# Altium schematic sheet E-08 eMMC.SchDoc: FRDM-IMX93
size 513 x 386 mm; DrawnBy: FORLINX; Organization: ORGANIZATION; Address1: ADDRESS 1; Address2: ADDRESS 2; Address3: ADDRESS 3; Address4: ADDRESS 4; Revision: -; ENG_APP_DATE: --/--/--; DSN_APP_DATE: --/--/--; CHK_APP_DATE: --/--/--; Classification: Public, Company Internal/Proprietary, Company Confidential,  Company Secret; Page Create Date: March  8, 1995; OrgName: NXP Semiconductor; FIUO: A; OrgAddr1: NO. 192 Liangjing Rd. Pudong New Area, ShangHai; Page Number: 8; PageTitle: eMMC; Page Size: C; Comment: TitleBlock_MCPG; Page Count: 23; Designer: FORLINX; RevCode: B1; Approver: NXP SE; Doc: SCH-94611 PDF: SPF-94611; DsnPath: T:\FILES\Designs\Single Board Computers\i.MX93-FRDM\Design Files\SCH-94611_B1.DSN; SchematicName: FRDM-i.MX 93 Development Board; PageName: E-08 eMMC; PageSize: C; TopSchematic: True
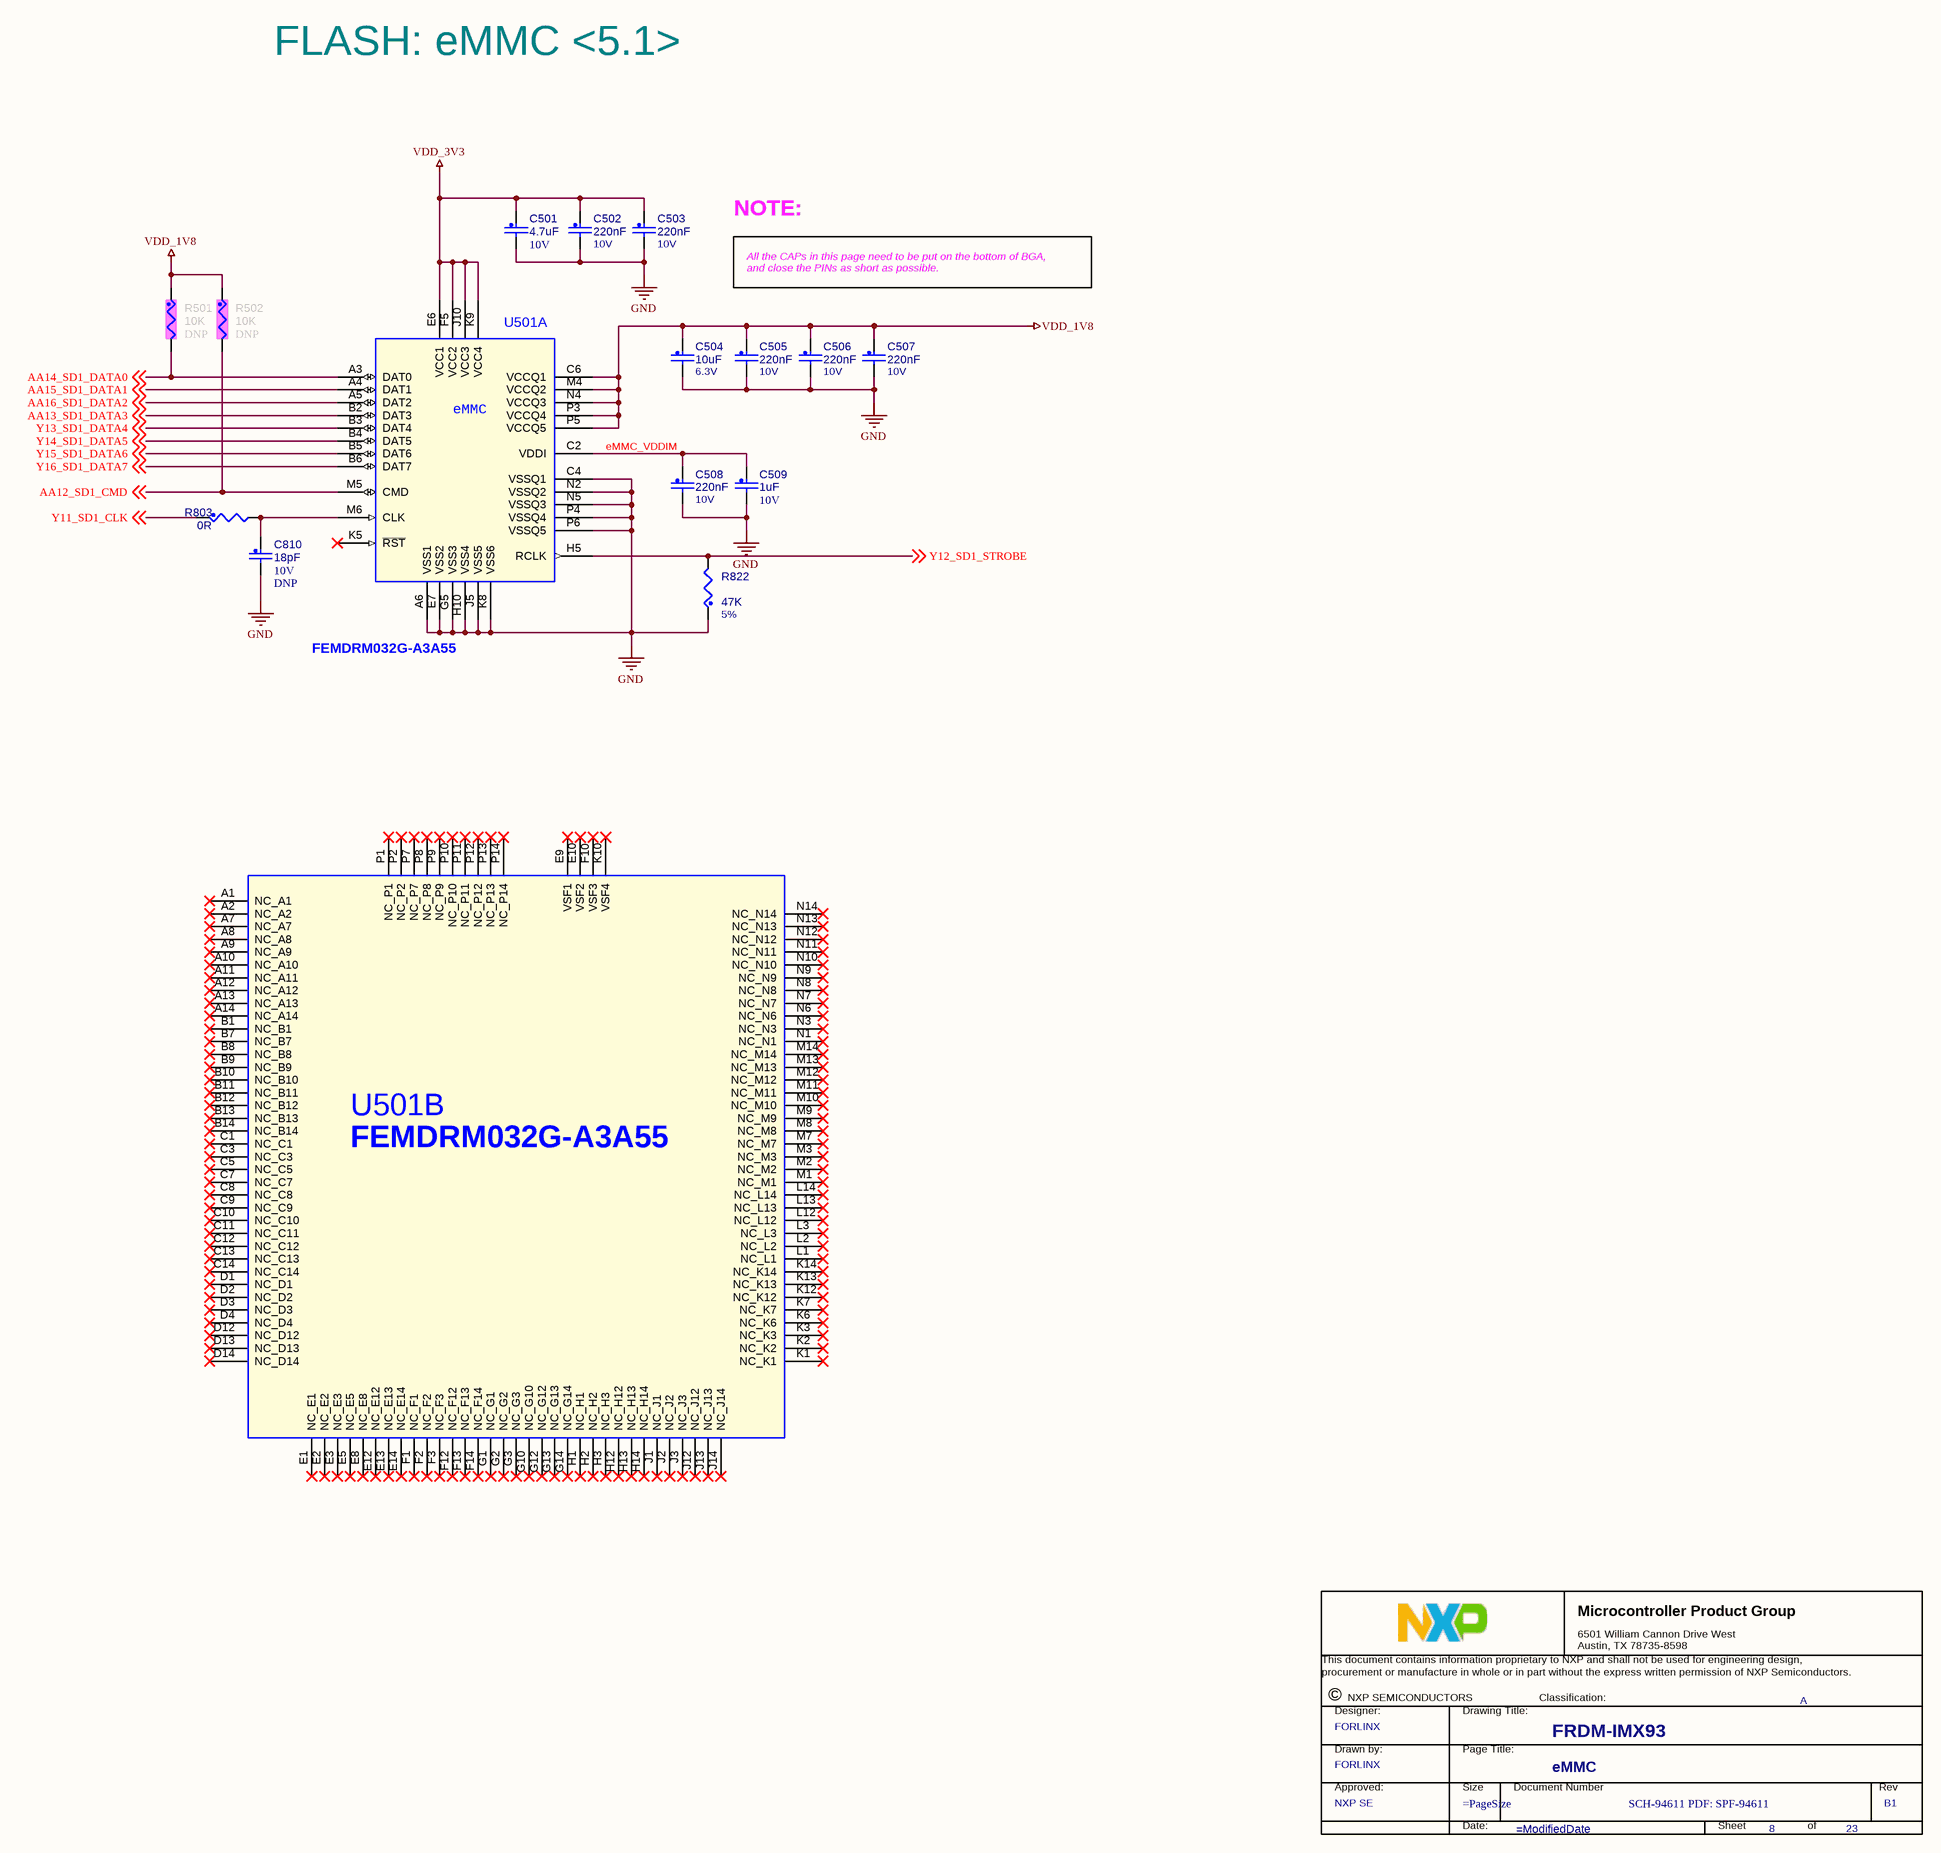
[diagram p0: E-08 eMMC.SchDoc]

## Parts
*  Title: FRDM-IMX93  RevCode: B1  PageTitle: eMMC  Page Number: 8  Page Count: 23  DrawnBy: FORLINX  Doc: SCH-94611 PDF: SPF-94611  Approver: NXP SE  FIUO: A  (hidden comment: TitleBlock_MCPG)  (graphical)
C501  4.7uF  VOLTAGE: 10V  [C0402]
C502  220nF  VOLTAGE: 10V  [C0201]
C503  220nF  VOLTAGE: 10V  [C0201]
C504  10uF  VOLTAGE: 6.3V  [C0402]
C505  220nF  VOLTAGE: 10V  [C0201]
C506  220nF  VOLTAGE: 10V  [C0201]
C507  220nF  VOLTAGE: 10V  [C0201]
C508  220nF  VOLTAGE: 10V  [C0201]
C509  1uF  VOLTAGE: 10V  [C0201]
C810  18pF  ASSY_OPT: DNP  VOLTAGE: 10V  [C0201]
R501  10K  ASSY_OPT: DNP  [R0201]
R502  10K  ASSY_OPT: DNP  [R0201]
R803  0R  [R0201]
R822  47K  Tolerance: 5%  [R0201]
U501  FEMDRM032G-A3A55  [fbga153_0p5_11p5x13]  (parts A,B of 2)

## Nets
GND: C501.2 C502.2 C503.2 C504.2 C505.2 C506.2 C507.2 C508.2 C509.2 C810.2 R822.1 U501.A6(VSS1) U501.C4(VSSQ1) U501.E7(VSS2) U501.G5(VSS3) U501.H10(VSS4) U501.J5(VSS5) U501.K8(VSS6) U501.N2(VSSQ2) U501.N5(VSSQ3) U501.P4(VSSQ4) U501.P6(VSSQ5)
VDD_1V8: C504.1 C505.1 C506.1 C507.1 R501.1 R502.1 U501.C6(VCCQ1) U501.M4(VCCQ2) U501.N4(VCCQ3) U501.P3(VCCQ4) U501.P5(VCCQ5)
VDD_3V3: C501.1 C502.1 C503.1 U501.E6(VCC1) U501.F5(VCC2) U501.J10(VCC3) U501.K9(VCC4)
AA12_SD1_CMD: R502.2 U501.M5(CMD) ; off-sheet AA12_SD1_CMD
AA13_SD1_DATA3: U501.B2(DAT3) ; off-sheet AA13_SD1_DATA3
AA14_SD1_DATA0: R501.2 U501.A3(DAT0) ; off-sheet AA14_SD1_DATA0
AA15_SD1_DATA1: U501.A4(DAT1) ; off-sheet AA15_SD1_DATA1
AA16_SD1_DATA2: U501.A5(DAT2) ; off-sheet AA16_SD1_DATA2
eMMC_VDDIM: C508.1 C509.1 U501.C2(VDDI)
Y11_SD1_CLK: R803.1 ; off-sheet Y11_SD1_CLK
Y12_SD1_STROBE: R822.2 U501.H5(RCLK) ; off-sheet Y12_SD1_STROBE
Y13_SD1_DATA4: U501.B3(DAT4) ; off-sheet Y13_SD1_DATA4
Y14_SD1_DATA5: U501.B4(DAT5) ; off-sheet Y14_SD1_DATA5
Y15_SD1_DATA6: U501.B5(DAT6) ; off-sheet Y15_SD1_DATA6
Y16_SD1_DATA7: U501.B6(DAT7) ; off-sheet Y16_SD1_DATA7
NetC810_1: C810.1 R803.2 U501.M6(CLK)

Not connected (* = marked no-connect by the designer): U501 A1(NC_A1)* A2(NC_A2)* A7(NC_A7)* A8(NC_A8)* A9(NC_A9)* A10(NC_A10)* A11(NC_A11)* A12(NC_A12)* A13(NC_A13)* A14(NC_A14)* B1(NC_B1)* B7(NC_B7)* B8(NC_B8)* B9(NC_B9)* B10(NC_B10)* B11(NC_B11)* B12(NC_B12)* B13(NC_B13)* B14(NC_B14)* C1(NC_C1)* C3(NC_C3)* C5(NC_C5)* C7(NC_C7)* C8(NC_C8)* C9(NC_C9)* C10(NC_C10)* C11(NC_C11)* C12(NC_C12)* C13(NC_C13)* C14(NC_C14)* D1(NC_D1)* D2(NC_D2)* D3(NC_D3)* D4(NC_D4)* D12(NC_D12)* D13(NC_D13)* D14(NC_D14)* E1(NC_E1)* E2(NC_E2)* E3(NC_E3)* E5(NC_E5)* E8(NC_E8)* E9(VSF1)* E10(VSF2)* E12(NC_E12)* E13(NC_E13)* E14(NC_E14)* F1(NC_F1)* F2(NC_F2)* F3(NC_F3)* F10(VSF3)* F12(NC_F12)* F13(NC_F13)* F14(NC_F14)* G1(NC_G1)* G2(NC_G2)* G3(NC_G3)* G10(NC_G10)* G12(NC_G12)* G13(NC_G13)* G14(NC_G14)* H1(NC_H1)* H2(NC_H2)* H3(NC_H3)* H12(NC_H12)* H13(NC_H13)* H14(NC_H14)* J1(NC_J1)* J2(NC_J2)* J3(NC_J3)* J12(NC_J12)* J13(NC_J13)* J14(NC_J14)* K1(NC_K1)* K2(NC_K2)* K3(NC_K3)* K5(~{RST})* K6(NC_K6)* K7(NC_K7)* K10(VSF4)* K12(NC_K12)* K13(NC_K13)* K14(NC_K14)* L1(NC_L1)* L2(NC_L2)* L3(NC_L3)* L12(NC_L12)* L13(NC_L13)* L14(NC_L14)* M1(NC_M1)* M2(NC_M2)* M3(NC_M3)* M7(NC_M7)* M8(NC_M8)* M9(NC_M9)* M10(NC_M10)* M11(NC_M11)* M12(NC_M12)* M13(NC_M13)* M14(NC_M14)* N1(NC_N1)* N3(NC_N3)* N6(NC_N6)* N7(NC_N7)* N8(NC_N8)* N9(NC_N9)* N10(NC_N10)* N11(NC_N11)* N12(NC_N12)* N13(NC_N13)* N14(NC_N14)* P1(NC_P1)* P2(NC_P2)* P7(NC_P7)* P8(NC_P8)* P9(NC_P9)* P10(NC_P10)* P11(NC_P11)* P12(NC_P12)* P13(NC_P13)* P14(NC_P14)*

## Notes on the sheet
- FLASH: eMMC <5.1>
- NOTE:
- All the CAPs in this page need to be put on the bottom of BGA,
  and close the PINs as short as possible.
- DWG. NO.
- REV.
- SHT.
- REVISION
- DESCRIPTION
- DATE
- APPROVED
- ENG:
- APPROVALS
- quilter.ai <http://quilter.ai>
- DSN:
- CHK:
- REFERENCE DOCUMENTS
- TITLE
- PROJECT
- BOM:
- FAB DWG:
- PCB DWG:
- ASSY DWG:
- SIZE
- FILE NAME
- C
- DWG NO.
- SHEET
- OF
- REV
- (in symbol SDINBDA6_32G_I_VFBGA_153P, part A) eMMC
- (in symbol TitleBlock_MCPG) Microcontroller Product Group; 6501 William Cannon Drive West / Austin, TX 78735-8598; This document contains information proprietary to NXP and shall not be used for engineering design,; procurement or manufacture in whole or in part without the express written permission of NXP Semiconductors.; ©; NXP SEMICONDUCTORS; Classification:; Designer:; Drawing Title:; Drawn by:; Page Title:; Approved:; Size; Document Number; Rev; Date:; Sheet; of

## Library data of the parts
* = TitleBlock_MCPG: Classification: Public, Company Internal/Proprietary, Company Confidential,  Company Secret; OrgName: NXP Semiconductor; OrgAddr1: NO. 192 Liangjing Rd. Pudong New Area, ShangHai; Page Size: =PageSize; Page Create Date: March  8, 1995; Designer: FORLINX; Page Modify Date: =ModifiedDate
C501 = CAP_NP: 0402,4.7uF,10V,+/-10%,X5R; Part Reference: C501; CLASS: DISCRETE; FPLIST: cc0402_tol0p15,cc0402_tol0p15_ov,0402_cc_nsp; CAD_APPROVED: Yes; MFG_PN01: CL05A475KP5NRNC; MFG_NAME01: SAMSUNG; Tolerance: 10%; 3D_Mechanical_Footprint_File: cc0402_tol0p15; Value: 4.7uF; PCB Footprint: C0402; HEIGHT: 0.65MM; ROHS: Yes
C502 = CAP_NP: 0201,220nF,6.3V,+/-20%,X5R; Part Reference: C502; CLASS: DISCRETE; Tolerance: 20%; MFG_NAME01: SAMSUNG; MFG_PN01: CL03A224MQ3NNNC; CAD_APPROVED: Yes; FPLIST: CC0201,CC0201_HD,0201_CC; Value: 220nF; PCB Footprint: C0201; ROHS: Yes; HEIGHT: 0.33MM
C503 = CAP_NP: 0201,220nF,6.3V,+/-20%,X5R; Part Reference: C503; CLASS: DISCRETE; FPLIST: CC0201,CC0201_HD,0201_CC; CAD_APPROVED: Yes; MFG_PN01: CL03A224MQ3NNNC; MFG_NAME01: SAMSUNG; Tolerance: 20%; Value: 220nF; PCB Footprint: C0201; HEIGHT: 0.33MM; ROHS: Yes
C504 = CAP_NP: 0402,10uF,6.3V,+/-20%,X5R; Part Reference: C504; CLASS: DISCRETE; FPLIST: CC0402_25,CC0402_HD,0402_CC; CAD_APPROVED: Yes; MFG_PN01: 0402X106M6R3NT; MFG_NAME01: FENGHUA; Tolerance: 20%; Value: 10uF; PCB Footprint: C0402; HEIGHT: 0.65 MM; ROHS: Yes
C505 = CAP_NP: 0201,220nF,6.3V,+/-20%,X5R; Part Reference: C505; CLASS: DISCRETE; FPLIST: CC0201,CC0201_HD,0201_CC; CAD_APPROVED: Yes; MFG_PN01: CL03A224MQ3NNNC; MFG_NAME01: SAMSUNG; Tolerance: 20%; Value: 220nF; PCB Footprint: C0201; HEIGHT: 0.33MM; ROHS: Yes
C506 = CAP_NP: 0201,220nF,6.3V,+/-20%,X5R; Part Reference: C506; CLASS: DISCRETE; FPLIST: CC0201,CC0201_HD,0201_CC; CAD_APPROVED: Yes; MFG_PN01: CL03A224MQ3NNNC; MFG_NAME01: SAMSUNG; Tolerance: 20%; Value: 220nF; PCB Footprint: C0201; HEIGHT: 0.33MM; ROHS: Yes
C507 = CAP_NP: 0201,220nF,6.3V,+/-20%,X5R; Part Reference: C507; CLASS: DISCRETE; Tolerance: 20%; MFG_NAME01: SAMSUNG; MFG_PN01: CL03A224MQ3NNNC; CAD_APPROVED: Yes; FPLIST: CC0201,CC0201_HD,0201_CC; Value: 220nF; PCB Footprint: C0201; ROHS: Yes; HEIGHT: 0.33MM
C508 = CAP_NP: 0201,220nF,6.3V,+/-20%,X5R; Part Reference: C508; CLASS: DISCRETE; Tolerance: 20%; MFG_NAME01: SAMSUNG; MFG_PN01: CL03A224MQ3NNNC; CAD_APPROVED: Yes; FPLIST: CC0201,CC0201_HD,0201_CC; Value: 220nF; PCB Footprint: C0201; ROHS: Yes; HEIGHT: 0.33MM
C509 = CAP_NP: 0201,1uF,10V,+/-20%,X5R; Part Reference: C509; CLASS: DISCRETE; Temp Range: -55¡ãC to 85¡ãC; FPLIST: CC0201,CC0201_HD,0201_CC,cc_0201_cir; CAD_APPROVED: Yes; MFG_PN01: CL03A105MP3NSNC; MFG_NAME01: SAMSUNG; Tolerance: 10%; Value: 1uF; PCB Footprint: C0201; HEIGHT: 0.35MM; ROHS: Yes; Package Size: 0201 (0603 Metric); Package Type: SMD/SMT
C810 = CAP_NP: 0201,18pF,50V,+/-5%,NPO; Part Reference: C810; CLASS: DISCRETE; Temp Range: -55¡ãC to 85¡ãC; FPLIST: CC0201,CC0201_HD,0201_CC,cc_0201_cir; CAD_APPROVED: Yes; MFG_PN01: 0201CG180J500NT; MFG_NAME01: FENGHUA; Tolerance: 10%; Value: 18pF; PCB Footprint: C0201; HEIGHT: 0.35MM; ROHS: Yes; Package Size: 0201 (0603 Metric); Package Type: SMD/SMT
R501 = RES: 0201,10K,+/-5%; Part Reference: R501; CLASS: DISCRETE; Tolerance: 5%; MFG_NAME01: FENGHUA; MFG_PN01: RC-01W103JT; CAD_APPROVED: Yes; FPLIST: RC0402_25,RC0402_HD,0402_CC; Value: 10K; PCB Footprint: R0201; ROHS: Yes; HEIGHT: 0.4 MM
R502 = RES: 0201,10K,+/-5%; Part Reference: R502; CLASS: DISCRETE; FPLIST: RC0402_25,RC0402_HD,0402_CC; CAD_APPROVED: Yes; MFG_PN01: RC-01W103JT; MFG_NAME01: FENGHUA; Tolerance: 5%; Value: 10K; PCB Footprint: R0201; HEIGHT: 0.4 MM; ROHS: Yes
R803 = RES: 0201,0Ohm,+/-5%; Part Reference: R803; CLASS: DISCRETE; FPLIST: RC0402_25,RC0402_HD,0402_CC; CAD_APPROVED: Yes; MFG_PN01: RC-01000JT; MFG_NAME01: FENGHUA; Tolerance: 5%; Value: 0R; PCB Footprint: R0201; HEIGHT: 0.4 MM; ROHS: Yes
R822 = RES: 0201,47K,5%; Part Reference: R822; CLASS: DISCRETE; FPLIST: RC0201,0201_CC; CAD_APPROVED: Yes; Temp_Range: -55¡ãC ~ 125¡ãC; MFG_PN01: RC-01W473JT; MFG_NAME01: FENGHUA; VOLTAGE: 25V; Value: 47K; PCB Footprint: R0201; HEIGHT: 0.26MM; ROHS: Yes; Temp Range: -55¡ãC ~ 125¡ãC
U501 = SDINBDA6_32G_I_VFBGA_153P: FEMDRM032G-A3A55,153FBGA,eMMC5.1,32GB,-25~85+C; Part Reference: U501; CLASS: IC; CAD_APPROVED: Yes; Temp Range: -25¡ãC to 85¡ãC; MFG_NAME01: FORESEE; Value: FEMDRM032G-A3A55; HEIGHT: 1MM; ROHS: Yes; MFG_PN01: FEMDRM032G-A3A55; PCB Footprint: fbga153_0p5_11p5x13